# EAGLE design sweeperino (EAGLE 7.5.0)
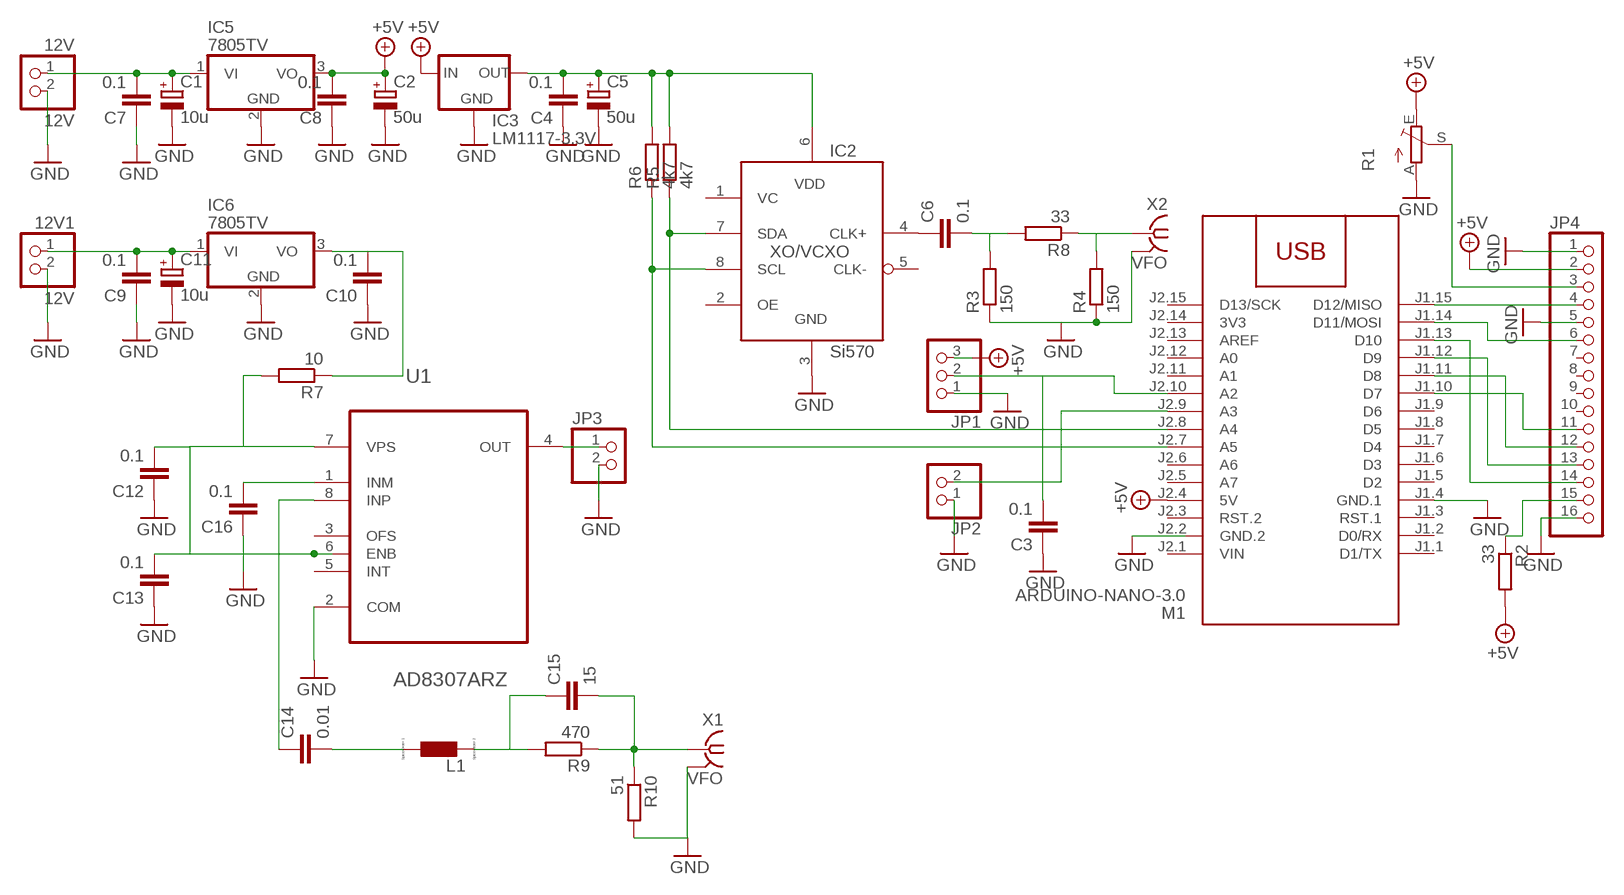
[diagram p0: schematic, sheet 1]

## Parts
12V  12V  PINHD-1X2  [1X02]
12V1  12V  PINHD-1X2  [1X02]
C1  10u  CPOL-EUE2.5-5  [E2,5-5]
C2  50u  CPOL-EUE2.5-5  [E2,5-5]
C3  0.1  C-EU050-024X044  [C050-024X044]
C4  0.1  C-EU050-024X044  [C050-024X044]
C5  50u  CPOL-EUE2.5-5  [E2,5-5]
C6  0.1  C-EU050-024X044  [C050-024X044]
C7  0.1  C-EU050-024X044  [C050-024X044]
C8  0.1  C-EU050-024X044  [C050-024X044]
C9  0.1  C-EU050-024X044  [C050-024X044]
C10  0.1  C-EU050-024X044  [C050-024X044]
C11  10u  CPOL-EUE2.5-5  [E2,5-5]
C12  0.1  C-EU050-024X044  [C050-024X044]
C13  0.1  C-EU050-024X044  [C050-024X044]
C14  0.01  C-EU050-024X044  [C050-024X044]
C15  15  C-EU050-024X044  [C050-024X044]
C16  0.1  C-EU050-024X044  [C050-024X044]
IC2  Si570  SI57X  [SI57X]
IC3  LM1117-3.3V  LM1117TO252  [TO252]
IC5  7805TV  [TO220V]
IC6  7805TV  [TO220V]
JP1  PINHD-1X3  [1X03]
JP2  PINHD-1X2  [1X02]
JP3  PINHD-1X2  [1X02]
JP4  PINHD-1X16  [1X16]
L1  L0204/7  [0204/7]
M1  ARDUINO-NANO-3.0  [ARDUINO-NANO-3.0]
R1  TRIM_EU-CA6V  [CA6V]
R2  33  R-EU_0204/5  [0204/5]
R3  150  R-EU_0204/5  [0204/5]
R4  150  R-EU_0204/5  [0204/5]
R5  4k7  R-EU_0204/5  [0204/5]
R6  4k7  R-EU_0204/5  [0204/5]
R7  10  R-EU_0204/5  [0204/5]
R8  33  R-EU_0204/5  [0204/5]
R9  470  R-EU_0204/5  [0204/5]
R10  51  R-EU_0204/5  [0204/5]
U1  AD8307ARZ  [SOIC127P600X175-8N]
X1  VFO  BU-SMA-V  [BU-SMA-V]
X2  VFO  BU-SMA-V  [BU-SMA-V]

## Nets
+5V: C2.+ C8.2 IC3.2(IN) IC5.3(VO) JP1.3 JP4.2 M1.J2.4(5V) R1.E R2.2
GND: 12V1.2 12V.2 C1.- C2.- C3.1 C4.1 C5.- C7.1 C8.1 C9.1 C10.1 C11.- C12.1 C13.1 C16.1 IC2.3(GND) IC3.1(GND) IC5.2(GND) JP1.1 JP2.1 JP3.2 JP4.1 JP4.5 JP4.16 M1.J1.4(GND.1) R1.A R3.1 R4.1 R10.2 U1.2(COM) X1.2(GND) X2.2(GND)
N$1: JP3.1 U1.4(OUT)
N$2: C10.2 IC6.3(VO) R7.1
N$3: C14.1 U1.8(INP)
N$4: C3.2 JP1.2 M1.J2.10(A2)
N$5: JP4.3 R1.S
N$6: JP4.4 M1.J1.15(D12/MISO)
N$7: JP4.6 M1.J1.14(D11/MOSI)
N$8: JP4.11 M1.J1.10(D7)
N$9: JP4.12 M1.J1.11(D8)
N$10: JP4.13 M1.J1.12(D9)
N$11: C6.2 R3.2 R8.2
N$12: R4.2 R8.1 X2.1
N$13: JP4.14 M1.J1.13(D10)
N$14: JP4.15 R2.1
N$15: 12V1.1 C9.2 C11.+ IC6.1(VI)
N$16: C12.2 C13.2 R7.2 U1.6(ENB) U1.7(VPS)
N$17: JP2.2 M1.J2.9(A3)
N$18: C14.2 L1.1
N$19: IC2.7(SDA) M1.J2.8(A4) R5.1
N$20: IC2.8(SCL) M1.J2.7(A5) R6.1
N$21: C4.2 C5.+ IC2.6(VDD) IC3.3(OUT) R5.2 R6.2
N$22: C6.1 IC2.4(CLK+)
N$23: C15.1 L1.2 R9.2
N$24: C16.2 U1.1(INM)
N$25: C15.2 R9.1 R10.1 X1.1
N$26: 12V.1 C1.+ C7.2 IC5.1(VI)
Unconnected: IC2.1(VC) IC2.2(OE) IC2.5(CLK-) IC6.2(GND) JP4.7 JP4.8 JP4.9 JP4.10 M1.J1.1(D1/TX) M1.J1.2(D0/RX) M1.J1.3(RST.1) M1.J1.5(D2) M1.J1.6(D3) M1.J1.7(D4) M1.J1.8(D5) M1.J1.9(D6) M1.J2.3(RST.2) M1.J2.5(A7) M1.J2.6(A6) M1.J2.11(A1) M1.J2.12(A0) M1.J2.13(AREF) M1.J2.15(D13/SCK) U1.3(OFS) U1.5(INT)

## Power pins joined to a net without a drawn wire
3V3: M1.J2.14(3V3)
GND: X1.3(GND) X1.4(GND) X1.5(GND) X2.3(GND) X2.4(GND) X2.5(GND)
GND.2: M1.J2.2(GND.2)
VIN: M1.J2.1(VIN)

## Library data of the parts
12V 12V1 JP2 JP3 = pinhead:PINHD-1X2: PIN HEADER
C1 C2 C5 C11 = rcl:CPOL-EU: POLARIZED CAPACITOR, European symbol
C3 C4 C6-C10 C12-C16 = rcl:C-EU: CAPACITOR, European symbol
IC2 = si57x:SI57X: Any Rate I2C Prorammable XO/VCXO SiliconLabs Si570 XO and Si571 VCXO
IC3 = v-reg-2:LM1117
IC5 IC6 = linear:78*: Positive VOLTAGE REGULATOR Source: http://cache.national.com/ds/LM/LM78L05.pdf http://www.fairchildsemi.com/ds/LM/LM7805.pdf
JP1 = pinhead:PINHD-1X3: PIN HEADER
JP4 = pinhead:PINHD-1X16: PIN HEADER
L1 = eagle-ltspice:L: INDUCTOR, European symbol; SPICEMODEL: NONE; SPICEPREFIX: L
M1 = diy-modules:ARDUINO-NANO-3.0: Arduino Nano 3.0
R1 = pot:TRIM_EU-: POTENTIOMETER
R2-R10 = rcl:R-EU_: RESISTOR, European symbol
U1 = Analog Devices_By_element14_Batch_1:AD8307ARZ: Low Cost, DC to 500 MHz, 92 dB Logarithmic Amplifier; MPN: AD8307ARZ; OC_FARNELL: 1661041; OC_NEWARK: 59K6564; PACKAGE: SOIC-8; SUPPLIER: Analog Devices
X1 X2 = con-coax:BU-SMA-V: FEMALE SMA CONNECTOR Radiall distributor RS 112-3794; OC_FARNELL: unknown; OC_NEWARK: unknown

## Board
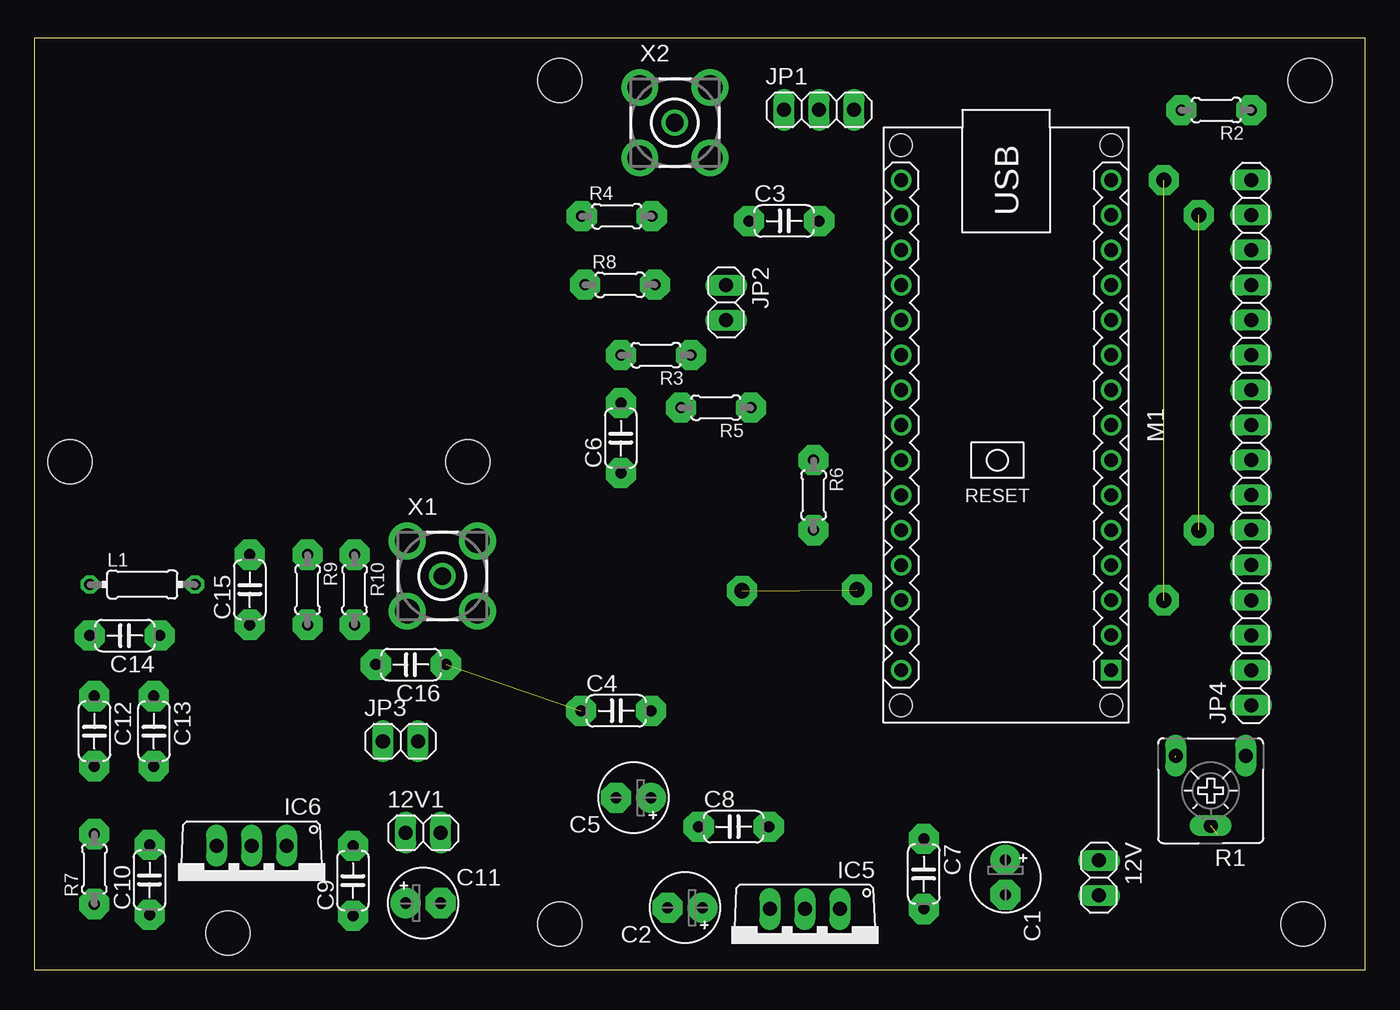
[diagram p1: board, top side]
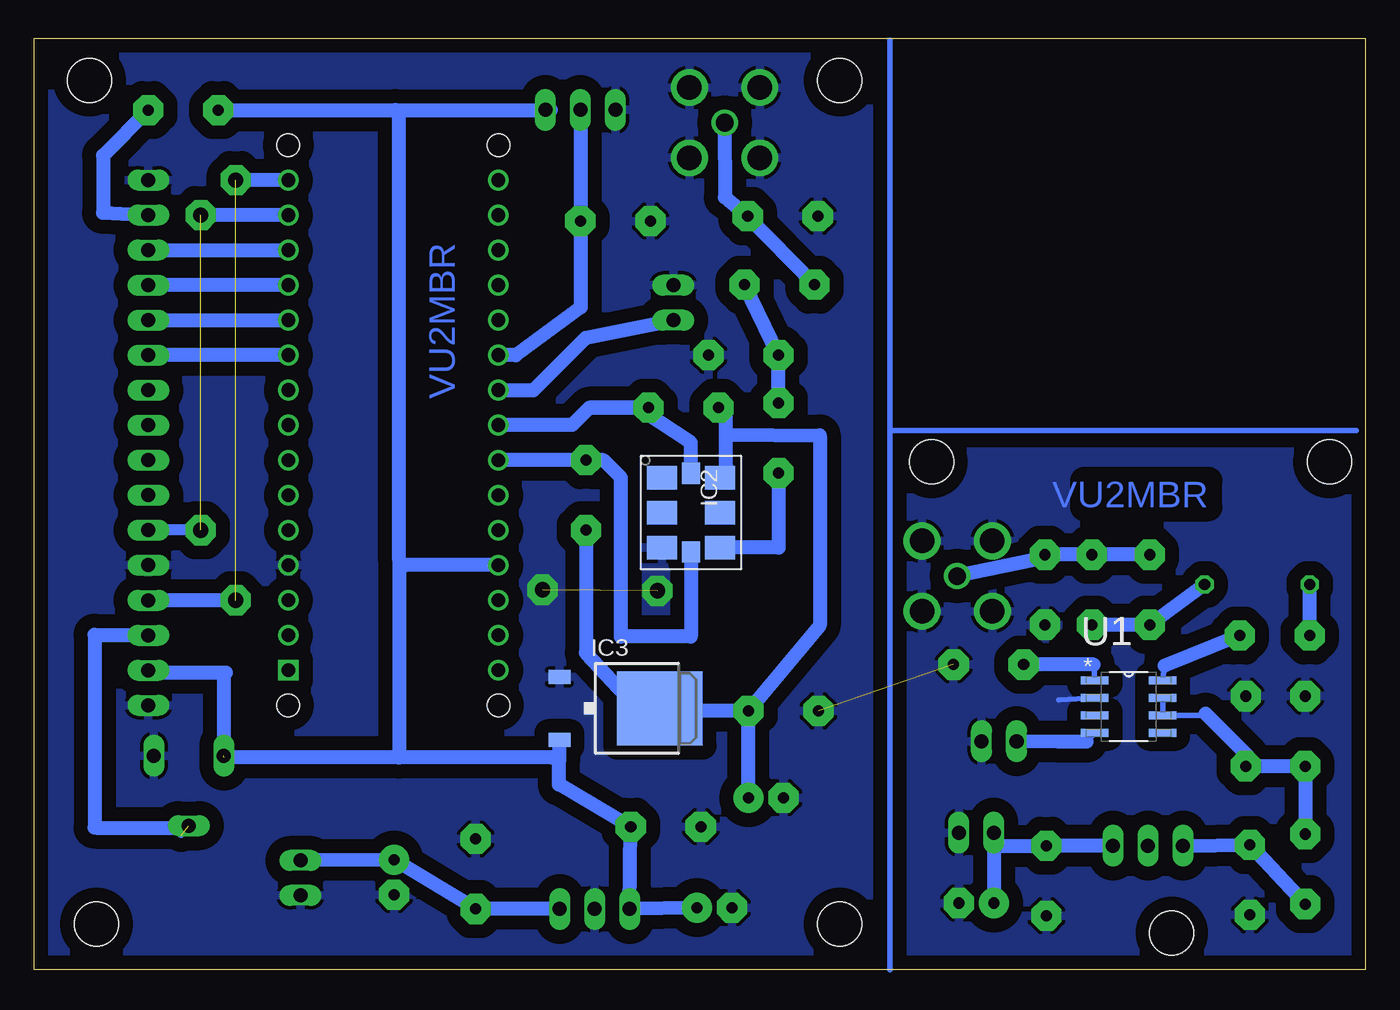
[diagram p2: board, bottom side, seen from below]

Size 96.52 x 67.56 mm. Coordinates in mm from the lower left corner, seen from the top.
Outline: 0,0 96.52,0 96.52,67.56 0,67.56 0,0
Copper layers (1*16): Top 0.035mm / dielectric 1.5mm / Bottom 0.035mm
Design rules "default": minimum track width 10mil, minimum drill 24mil, track to track 8mil, track to pad 8mil, pad to pad 8mil, via to via 8mil, smd to smd 8mil, copper to edge 40mil, drill to drill 8mil, minimum pad ring 10mil, minimum via ring 8mil, stop-mask expansion 4mil, vias tented up to drill 0mil, thermal gap 10mil
Holes 3.2 mm at 14.02,2.67 2.59,36.83 31.45,36.83 38.1,3.3 92.02,3.3 38.1,64.52 92.53,64.52

### Footprints (pad centres in the part's own frame; a part is rotated, then mirrored left to right if it is on the bottom)
1X02 = drill 1.016 long: 1 -1.27,0; 2 1.27,0
E2,5-5 = drill 0.8 pad 2.184: + -1.27,0 | drill 0.8 pad 2.184 octagon: - 1.27,0
C050-024X044 = drill 0.8 pad 2.184 octagon: 1 -2.54,0; 2 2.54,0
SI57X = smd 1.7 x 2.15: 1 -2.54,-2.1; 2 0,-2.1; 3 2.54,-2.1; 4 2.54,2.1; 5 0,2.1; 6 -2.54,2.1 | smd 1.545 x 1.3: 7 -2.853,0; 8 2.853,0
TO252 = smd 1 x 1.6: 1 -2.28,-6.07; 2 2.28,-6.07 | smd 5.4 x 6.2: 3 0,1.23
TO220V = drill 1.016 long: 1 -2.54,-2.54; 2 0,-2.54; 3 2.54,-2.54
1X03 = drill 1.016 long: 1 -2.54,0; 2 0,0; 3 2.54,0
1X16 = drill 1.016 long: 1 -19.05,0; 2 -16.51,0; 3 -13.97,0; 4 -11.43,0; 5 -8.89,0; 6 -6.35,0; 7 -3.81,0; 8 -1.27,0; 9 1.27,0; 10 3.81,0; 11 6.35,0; 12 8.89,0; 13 11.43,0; 14 13.97,0; 15 16.51,0; 16 19.05,0
0204/7 = drill 0.813 octagon: 1 -3.81,0; 2 3.81,0
ARDUINO-NANO-3.0 = drill 1 square: J1.1 17.78,7.62 | drill 1: J1.2 15.24,7.62; J1.3 12.7,7.62; J1.4 10.16,7.62; J1.5 7.62,7.62; J1.6 5.08,7.62; J1.7 2.54,7.62; J1.8 0,7.62; J1.9 -2.54,7.62; J1.10 -5.08,7.62; J1.11 -7.62,7.62; J1.12 -10.16,7.62; J1.13 -12.7,7.62; J1.14 -15.24,7.62; J1.15 -17.78,7.62; J2.1 17.78,-7.62; J2.2 15.24,-7.62; J2.3 12.7,-7.62; J2.4 10.16,-7.62; J2.5 7.62,-7.62; J2.6 5.08,-7.62; J2.7 2.54,-7.62; J2.8 0,-7.62; J2.9 -2.54,-7.62; J2.10 -5.08,-7.62; J2.11 -7.62,-7.62; J2.12 -10.16,-7.62; J2.13 -12.7,-7.62; J2.14 -15.24,-7.62; J2.15 -17.78,-7.62 | hole 1.651: -20.32,7.62; -20.32,-7.62; 20.32,-7.62; 20.32,7.62
CA6V = drill 1.016 long: A -2.54,-2.54; E 2.54,-2.54; S 0,2.54
0204/5 = drill 0.8 pad 2.184 octagon: 1 -2.54,0; 2 2.54,0
SOIC127P600X175-8N = smd 1.981 x 0.559: 1 -2.464,1.905; 2 -2.464,0.635; 3 -2.464,-0.635; 4 -2.464,-1.905; 5 2.464,-1.905; 6 2.464,-0.635; 7 2.464,0.635; 8 2.464,1.905
BU-SMA-V = drill 1.27: 1 0,0 | drill 1.778: 2 -2.55,2.55; 3 2.55,2.55; 4 2.55,-2.55; 5 -2.55,-2.55

### Placement (x,y rotation side)
12V  77.22,6.65 270 top
12V1  28.19,9.93 0 top
C1  70.43,6.71 270 top
C2  47.19,4.5 180 top
C3  54.38,54.31 0 top
C4  42.19,18.77 0 top
C5  43.46,12.47 180 top
C6  42.54,38.56 90 top
C7  64.52,6.93 270 top
C8  50.72,10.36 0 top
C9  23.11,6.45 90 top
C10  8.36,6.5 90 top
C11  28.19,4.83 0 top
C12  4.34,17.3 270 top
C13  8.66,17.3 270 top
C14  6.55,24.23 180 top
C15  15.62,27.56 90 top
C16  27.3,22.12 180 top
IC2  48.89,33.15 270 bottom
IC3  52.37,18.95 270 bottom
IC5  55.88,1.85 180 top
IC6  15.75,6.45 180 top
JP1  56.92,62.38 0 top
JP2  50.16,48.39 270 top
JP3  26.54,16.56 0 top
JP4  88.27,38.23 90 top
L1  7.82,27.94 0 top
M1  70.48,39.5 270 top
R1  85.32,12.98 180 top
R2  85.72,62.36 180 top
R3  45.09,44.58 180 top
R4  42.24,54.66 0 top
R5  49.43,40.77 180 top
R6  56.52,34.42 270 top
R7  4.34,7.29 90 top
R8  42.47,49.68 0 top
R9  19.81,27.56 270 top
R10  23.22,27.56 270 top
U1  17.14,19.08 0 bottom
X1  29.59,28.55 0 top
X2  46.46,61.44 0 top

### Tracks (layer width: path | path; a pad name or v marks a point on that pad's centre or on a via)
+5V  (1 unrouted)
  Bottom 0.406: 69.62,29.34 70.08,29.79 | 70.08,62.1 70.33,62.36 | 82.75,21.41 82.63,21.54 | 88.09,21.54 JP4.2 | IC3.2 58.98,15.39
  Bottom 1.016: R2.2 70.33,62.36 59.05,62.36 JP1.3 | M1.J2.4 69.62,29.34 | 70.08,62.1 70.08,29.79 70.08,15.39 | 70.08,15.39 82.75,15.39 82.75,21.41 | 82.63,21.54 88.09,21.54 | C2.+ IC5.3 C8.2 58.47,13.44 IC3.2 | 58.98,15.39 70.08,15.39
GND  (via drill 1.1 pad 2.18)  (2 unrouted)
  Bottom 0.406: U1.2 22.2,19.56
  other vias: 51.33,27.48 59.66,27.56
  pour Bottom (isolate 1.016): 96.6,67.77 96.34,0.05 0.51,0.08 0.51,67.79
N$1
  Bottom 0.406: U1.4 20.19,16.54
  Bottom 1.016: 20.19,16.54 22.23,16.54 JP3.1
N$2
  Bottom 1.016: R7.1 C10.2 IC6.3
N$3
  Bottom 0.406: 14.55,22.05 U1.8
  Bottom 1.016: C14.1 14.55,22.05
N$4
  Bottom 1.016: M1.J2.10 61.59,44.58 56.9,48.03 C3.2 JP1.2
N$5  (1 unrouted)
  Bottom 0.406: 91.97,24.26 92.15,24.31 | 92.15,10.29 92.02,10.29 | 86.41,10.29 85.88,9.75
  Bottom 1.016: JP4.3 91.97,24.26 | 92.15,24.31 92.15,10.29 | 92.02,10.29 86.41,10.29
N$6  (via drill 1.1 pad 2.18)  (1 unrouted)
  Bottom 1.016: M1.J1.15 v81.91,57.28 | v81.91,26.8 JP4.4
N$7  (via drill 1.1 pad 2.18)  (1 unrouted)
  Bottom 0.813: v84.45,31.88 JP4.6
  Bottom 1.016: M1.J1.14 v84.45,54.74
N$8
  Bottom 1.016: M1.J1.10 JP4.11
N$9
  Bottom 1.016: JP4.12 M1.J1.11
N$10
  Bottom 1.016: M1.J1.12 JP4.13
N$11
  Bottom 1.016: C6.2 R3.2 R8.2
N$12
  Bottom 1.016: R8.1 R4.2 46.43,56.03 X2.1
N$13
  Bottom 1.016: JP4.14 M1.J1.13
N$14
  Bottom 1.016: R2.1 91.54,59.05 91.54,54.91 JP4.15
N$15
  Bottom 0.406: C9.2 22.73,8.91 22.73,8.94
  Bottom 1.016: IC6.1 C9.2 | 12V1.1 26.92,8.94 | 26.92,8.94 C11.+ | 22.73,8.94 26.92,8.94
N$16
  Bottom 0.406: U1.7 U1.6 11.43,18.44 | C13.2 8.51,15.52
  Bottom 1.016: C13.2 C12.2 R7.2 | 8.51,15.52 11.43,18.44 11.56,18.57
N$17
  Bottom 1.016: M1.J2.9 60.33,42.04 56.52,45.85 JP2.2
N$18
  Bottom 1.016: C14.2 L1.1
N$19
  Bottom 0.406: 56.26,40.77 55.96,40.72 56.31,40.72 | 62.84,39.52 M1.J2.8 | 52.27,40.46 56.34,40.46 56.45,40.58
  Bottom 1.016: IC2.7 48.89,38.23 52.27,40.46 | R5.1 56.26,40.77 | 56.31,40.72 56.45,40.58 57.51,39.52 62.84,39.52
N$20
  Bottom 1.016: M1.J2.7 R6.1 55.24,36.96 53.97,35.69 53.97,24.16 48.89,24.16 IC2.8
N$21
  Bottom 0.406: 46.35,36.52 IC2.6 46.25,38.81 | IC3.3 52.15,18.95 | 52.15,18.95 52.72,18.95 52.75,18.92 | 51.97,18.77 52.15,18.95
  Bottom 1.016: 46.35,36.52 46.35,40.77 R5.2 | C5.+ C4.2 | R6.2 56.52,22.99 52.75,18.92 51.66,17.76 | C4.2 51.97,18.77 | 46.25,38.81 39.55,38.76 39.55,24.97 C4.2
N$22
  Bottom 1.016: C6.1 42.54,30.61 IC2.4
N$23
  Bottom 1.016: L1.2 C15.1 R9.2
N$24
  Bottom 0.406: U1.1 19.69,22.12
  Bottom 1.016: 19.69,22.12 C16.2
N$25
  Bottom 0.406: R10.1 22.94,30 22.94,29.92
  Bottom 1.016: C15.2 R9.1 R10.1 | 22.94,29.92 X1.1
N$26
  Bottom 1.016: IC5.1 C7.2 C1.+ 12V.1
N$27
  Bottom 0.406: 34.47,67.44 34.47,0
N$28
  Bottom 0.406: 0.64,39.12 34.29,39.12

### Text on the board
Bottom: VU2MBR | VU2MBR